# EAGLE design untitled (EAGLE 9.4.1)
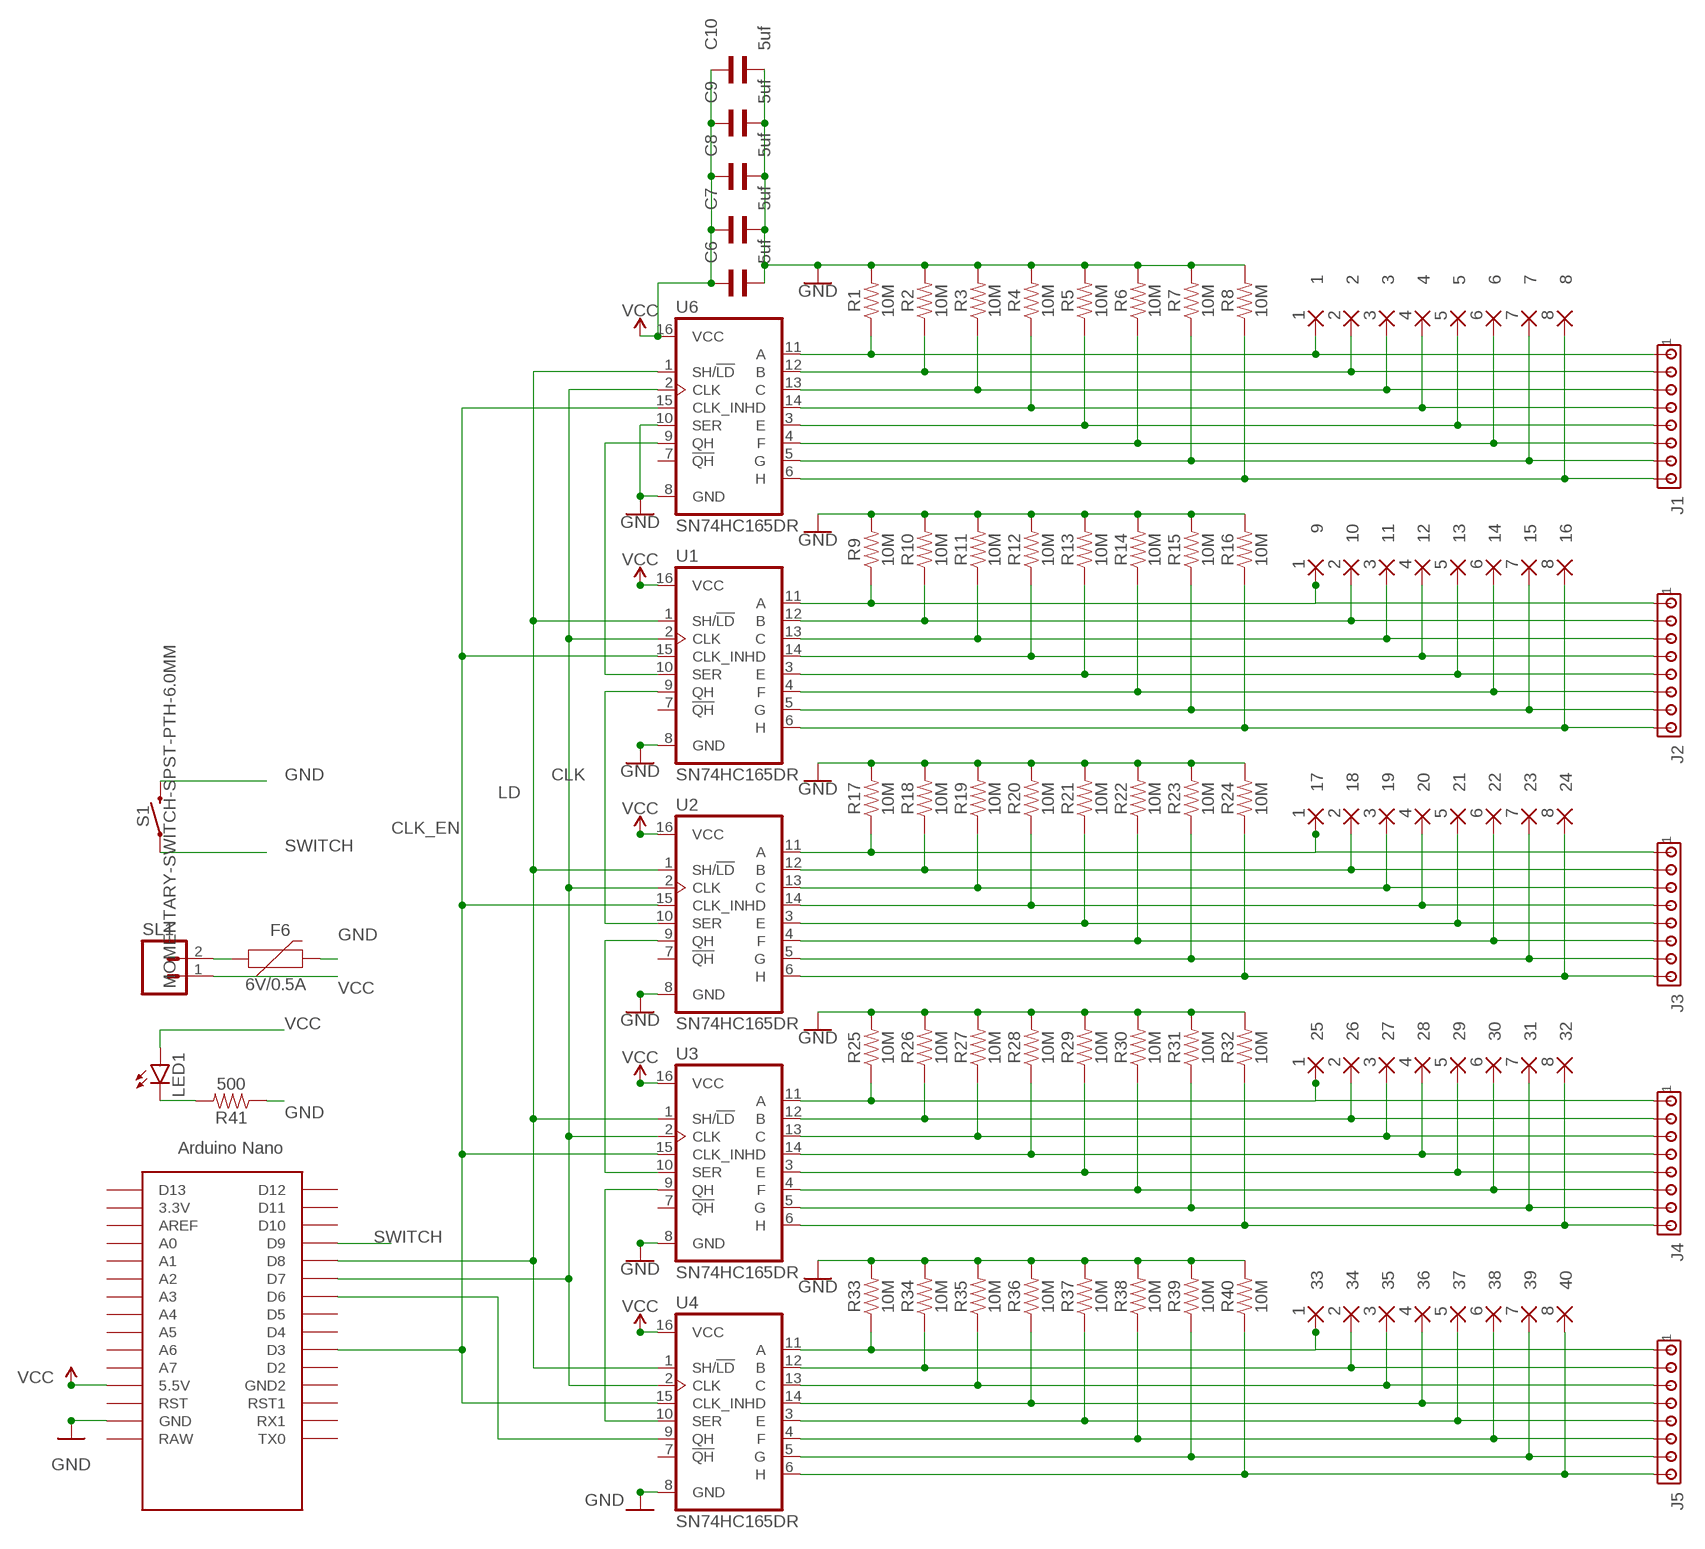
[diagram p0: schematic, sheet 1]

## Parts
1  1  WIREPADSMD5-1,8  [5-1,8]
2  2  WIREPADSMD5-1,8  [5-1,8]
3  3  WIREPADSMD5-1,8  [5-1,8]
4  4  WIREPADSMD5-1,8  [5-1,8]
5  5  WIREPADSMD5-1,8  [5-1,8]
6  6  WIREPADSMD5-1,8  [5-1,8]
7  7  WIREPADSMD5-1,8  [5-1,8]
8  8  WIREPADSMD5-1,8  [5-1,8]
9  1  WIREPADSMD5-1,8  [5-1,8]
10  2  WIREPADSMD5-1,8  [5-1,8]
11  3  WIREPADSMD5-1,8  [5-1,8]
12  4  WIREPADSMD5-1,8  [5-1,8]
13  5  WIREPADSMD5-1,8  [5-1,8]
14  6  WIREPADSMD5-1,8  [5-1,8]
15  7  WIREPADSMD5-1,8  [5-1,8]
16  8  WIREPADSMD5-1,8  [5-1,8]
17  1  WIREPADSMD5-1,8  [5-1,8]
18  2  WIREPADSMD5-1,8  [5-1,8]
19  3  WIREPADSMD5-1,8  [5-1,8]
20  4  WIREPADSMD5-1,8  [5-1,8]
21  5  WIREPADSMD5-1,8  [5-1,8]
22  6  WIREPADSMD5-1,8  [5-1,8]
23  7  WIREPADSMD5-1,8  [5-1,8]
24  8  WIREPADSMD5-1,8  [5-1,8]
25  1  WIREPADSMD5-1,8  [5-1,8]
26  2  WIREPADSMD5-1,8  [5-1,8]
27  3  WIREPADSMD5-1,8  [5-1,8]
28  4  WIREPADSMD5-1,8  [5-1,8]
29  5  WIREPADSMD5-1,8  [5-1,8]
30  6  WIREPADSMD5-1,8  [5-1,8]
31  7  WIREPADSMD5-1,8  [5-1,8]
32  8  WIREPADSMD5-1,8  [5-1,8]
33  1  WIREPADSMD5-1,8  [5-1,8]
34  2  WIREPADSMD5-1,8  [5-1,8]
35  3  WIREPADSMD5-1,8  [5-1,8]
36  4  WIREPADSMD5-1,8  [5-1,8]
37  5  WIREPADSMD5-1,8  [5-1,8]
38  6  WIREPADSMD5-1,8  [5-1,8]
39  7  WIREPADSMD5-1,8  [5-1,8]
40  8  WIREPADSMD5-1,8  [5-1,8]
C6  5uf  WCAP-CSGP_1206_885012208119  [WCAP-CSGP_1206]
C7  5uf  WCAP-CSGP_1206_885012208119  [WCAP-CSGP_1206]
C8  5uf  WCAP-CSGP_1206_885012208119  [WCAP-CSGP_1206]
C9  5uf  WCAP-CSGP_1206_885012208119  [WCAP-CSGP_1206]
C10  5uf  WCAP-CSGP_1206_885012208119  [WCAP-CSGP_1206]
F6  6V/0.5A  PPTC_HALF-AMP  [1206]
J1  MTA08-100  [10X08MTA]
J2  MTA08-100  [10X08MTA]
J3  MTA08-100  [10X08MTA]
J4  MTA08-100  [10X08MTA]
J5  MTA08-100  [10X08MTA]
LED1  LEDSML0805  [SML0805]
R1  10M  10MOHM-0603-1/10W-5%  [0603]
R2  10M  10MOHM-0603-1/10W-5%  [0603]
R3  10M  10MOHM-0603-1/10W-5%  [0603]
R4  10M  10MOHM-0603-1/10W-5%  [0603]
R5  10M  10MOHM-0603-1/10W-5%  [0603]
R6  10M  10MOHM-0603-1/10W-5%  [0603]
R7  10M  10MOHM-0603-1/10W-5%  [0603]
R8  10M  10MOHM-0603-1/10W-5%  [0603]
R9  10M  10MOHM-0603-1/10W-5%  [0603]
R10  10M  10MOHM-0603-1/10W-5%  [0603]
R11  10M  10MOHM-0603-1/10W-5%  [0603]
R12  10M  10MOHM-0603-1/10W-5%  [0603]
R13  10M  10MOHM-0603-1/10W-5%  [0603]
R14  10M  10MOHM-0603-1/10W-5%  [0603]
R15  10M  10MOHM-0603-1/10W-5%  [0603]
R16  10M  10MOHM-0603-1/10W-5%  [0603]
R17  10M  10MOHM-0603-1/10W-5%  [0603]
R18  10M  10MOHM-0603-1/10W-5%  [0603]
R19  10M  10MOHM-0603-1/10W-5%  [0603]
R20  10M  10MOHM-0603-1/10W-5%  [0603]
R21  10M  10MOHM-0603-1/10W-5%  [0603]
R22  10M  10MOHM-0603-1/10W-5%  [0603]
R23  10M  10MOHM-0603-1/10W-5%  [0603]
R24  10M  10MOHM-0603-1/10W-5%  [0603]
R25  10M  10MOHM-0603-1/10W-5%  [0603]
R26  10M  10MOHM-0603-1/10W-5%  [0603]
R27  10M  10MOHM-0603-1/10W-5%  [0603]
R28  10M  10MOHM-0603-1/10W-5%  [0603]
R29  10M  10MOHM-0603-1/10W-5%  [0603]
R30  10M  10MOHM-0603-1/10W-5%  [0603]
R31  10M  10MOHM-0603-1/10W-5%  [0603]
R32  10M  10MOHM-0603-1/10W-5%  [0603]
R33  10M  10MOHM-0603-1/10W-5%  [0603]
R34  10M  10MOHM-0603-1/10W-5%  [0603]
R35  10M  10MOHM-0603-1/10W-5%  [0603]
R36  10M  10MOHM-0603-1/10W-5%  [0603]
R37  10M  10MOHM-0603-1/10W-5%  [0603]
R38  10M  10MOHM-0603-1/10W-5%  [0603]
R39  10M  10MOHM-0603-1/10W-5%  [0603]
R40  10M  10MOHM-0603-1/10W-5%  [0603]
R41  500  10MOHM-0603-1/10W-5%  [0603]
S1  MOMENTARY-SWITCH-SPST-PTH-6.0MM  [TACTILE_SWITCH_PTH_6.0MM]
SL1  M02  [02P]
U1  SN74HC165DR  74HC165D  [SO16]
U2  SN74HC165DR  74HC165D  [SO16]
U3  SN74HC165DR  74HC165D  [SO16]
U4  SN74HC165DR  74HC165D  [SO16]
U6  SN74HC165DR  74HC165D  [SO16]
U$1  NANO  [NANO]

## Nets
B1: 2.1(P) J1.2 R2.1 U6.12(B)
C1: 3.1(P) J1.3 R3.1 U6.13(C)
CLK: U1.2(CLK) U2.2(CLK) U3.2(CLK) U4.2(CLK) U6.2(CLK) U$1.D7
CLK_EN: U1.15(CLK_INH) U2.15(CLK_INH) U3.15(CLK_INH) U4.15(CLK_INH) U6.15(CLK_INH) U$1.D3
D1: 4.1(P) J1.4 R4.1 U6.14(D)
E1: 5.1(P) J1.5 R5.1 U6.3(E)
F1: 6.1(P) J1.6 R6.1 U6.4(F)
G1: 7.1(P) J1.7 R7.1 U6.5(G)
GND [vcc]: C6.1 C7.1 C8.1 C9.1 C10.1 F6.2 R1.2 R2.2 R3.2 R4.2 R5.2 R6.2 R7.2 R8.2 R9.2 R10.2 R11.2 R12.2 R13.2 R14.2 R15.2 R16.2 R17.2 R18.2 R19.2 R20.2 R21.2 R22.2 R23.2 R24.2 R25.2 R26.2 R27.2 R28.2 R29.2 R30.2 R31.2 R32.2 R33.2 R34.2 R35.2 R36.2 R37.2 R38.2 R39.2 R40.2 R41.1 S1.3 U1.8(GND) U2.8(GND) U3.8(GND) U4.8(GND) U6.8(GND) U6.10(SER) U$1.GND
H1: 8.1(P) J1.8 R8.1 U6.6(H)
LD: U1.1(SH/!LD) U2.1(SH/!LD) U3.1(SH/!LD) U4.1(SH/!LD) U6.1(SH/!LD) U$1.D8
N$1: U1.10(SER) U6.9(QH)
N$2: U1.9(QH) U2.10(SER)
N$3: U2.9(QH) U3.10(SER)
N$4: U3.9(QH) U4.10(SER)
N$5: 1.1(P) J1.1 R1.1 U6.11(A)
N$6: F6.1 SL1.2
N$7: U4.9(QH) U$1.D6
N$11: LED1.C R41.2
N$15: 9.1(P) J2.1 R9.1 U1.11(A)
N$16: 10.1(P) J2.2 R10.1 U1.12(B)
N$17: 11.1(P) J2.3 R11.1 U1.13(C)
N$18: 12.1(P) J2.4 R12.1 U1.14(D)
N$19: 13.1(P) J2.5 R13.1 U1.3(E)
N$20: 14.1(P) J2.6 R14.1 U1.4(F)
N$21: 15.1(P) J2.7 R15.1 U1.5(G)
N$22: 16.1(P) J2.8 R16.1 U1.6(H)
N$23: 17.1(P) J3.1 R17.1 U2.11(A)
N$24: 18.1(P) J3.2 R18.1 U2.12(B)
N$25: 19.1(P) J3.3 R19.1 U2.13(C)
N$26: 20.1(P) J3.4 R20.1 U2.14(D)
N$27: 21.1(P) J3.5 R21.1 U2.3(E)
N$28: 22.1(P) J3.6 R22.1 U2.4(F)
N$29: 23.1(P) J3.7 R23.1 U2.5(G)
N$30: 24.1(P) J3.8 R24.1 U2.6(H)
N$31: 25.1(P) J4.1 R25.1 U3.11(A)
N$32: 26.1(P) J4.2 R26.1 U3.12(B)
N$33: 27.1(P) J4.3 R27.1 U3.13(C)
N$34: 28.1(P) J4.4 R28.1 U3.14(D)
N$35: 29.1(P) J4.5 R29.1 U3.3(E)
N$36: 30.1(P) J4.6 R30.1 U3.4(F)
N$37: 31.1(P) J4.7 R31.1 U3.5(G)
N$38: 32.1(P) J4.8 R32.1 U3.6(H)
N$39: 33.1(P) J5.1 R33.1 U4.11(A)
N$40: 34.1(P) J5.2 R34.1 U4.12(B)
N$41: 35.1(P) J5.3 R35.1 U4.13(C)
N$42: 36.1(P) J5.4 R36.1 U4.14(D)
N$43: 37.1(P) J5.5 R37.1 U4.3(E)
N$44: 38.1(P) J5.6 R38.1 U4.4(F)
N$45: 39.1(P) J5.7 R39.1 U4.5(G)
N$46: 40.1(P) J5.8 R40.1 U4.6(H)
SWITCH: S1.1 U$1.D9
VCC [vcc]: C6.2 C7.2 C8.2 C9.2 C10.2 LED1.A SL1.1 U1.16(VCC) U2.16(VCC) U3.16(VCC) U4.16(VCC) U6.16(VCC) U$1.5V(5.5V)
Unconnected: U1.7(!QH) U2.7(!QH) U3.7(!QH) U4.7(!QH) U6.7(!QH) U$1.3.3V U$1.A0 U$1.A1 U$1.A2 U$1.A3 U$1.A4 U$1.A5 U$1.A6 U$1.A7 U$1.AREF U$1.D2 U$1.D4 U$1.D5 U$1.D10 U$1.D11 U$1.D12 U$1.D13 U$1.GND1(GND2) U$1.ICSP1 U$1.ICSP2 U$1.ICSP3 U$1.ICSP4 U$1.ICSP5 U$1.ICSP6 U$1.RAW U$1.RST U$1.RST1 U$1.RX1 U$1.TX0

## Library data of the parts
1-40 = wirepad:WIREPAD: Wire PAD connect wire on PCB
C6-C10 = Wurth_Elektronik_Passive_Capacitors_rev18b:WCAP-CSGP_1206: WCAP-CSGP Ceramic Capacitors Characteristics Multilayer Ceramic Chip Capacitor Recommended soldering:Reflow, for 0603 and 0805 wave soldering is also allowed Operating temperature:-55 °C to +125 °C; Ceramic characteristics: Class I - NPO ; Class II -X7R, X5R High performance ceramic High capacitance stability Minimal aging Termination:Cu/Ni/Sn <http://katalog.we-online.de/media/images/eisos/WCAP-CSGP_pf2.jpg> Details see: http://katalog.we-online.de/en/pbs/WCAP-CSGP-1206? Created: 2015-01-28 2015 (C) Wurth Elektronik
F6 = SparkFun-Fuses:PPTC: Resettable Fuse PPTC Resettable Fuse. Really a sort of resistor with a polymeric positive temperature coefficient whose resistance increases dramatically with an increase in temperature. When heated by the power passing through the resistance rises causing the current to be limited, protecting the circuit. This is achieved by the transition of the polymer from a crystalline to an amorphous state where the conductive carbon separates breaking the conductive pathways found in the cool crystalline structure. When a PPTC cools back down it resumes conducting letting the circuit turn back on. SparkFun Products: SparkFun RedBoard - Programmed with Arduino <https://www.sparkfun.com/products/12757> Pro Micro - 5V/16MHz <https://www.sparkfun.com/products/12640> Arduino Pro 328 - 5V/16MHz <https://www.sparkfun.com/products/10915> MP3 Trigger <https://www.sparkfun.com/products/13720>; PROD_ID: RES-08585
J1-J5 = con-amp:MTA08-100: AMP connector
LED1 = led:LED: LED OSRAM: - CHIPLED LG R971, LG N971, LY N971, LG Q971, LY Q971, LO R971, LY R971 LH N974, LH R974 LS Q976, LO Q976, LY Q976 LO Q996 - Hyper CHIPLED LW Q18S LB Q993, LB Q99A, LB R99A - SideLED LS A670, LO A670, LY A670, LG A670, LP A670 LB A673, LV A673, LT A673, LW A673 LH A674 LY A675 LS A676, LA A676, LO A676, LY A676, LW A676 LS A679, LY A679, LG A679 - Hyper Micro SIDELED® LS Y876, LA Y876, LO Y876, LY Y876 LT Y87S - SmartLED LW L88C, LW L88S LB L89C, LB L89S, LG L890 LS L89K, LO L89K, LY L89K LS L896, LA L896, LO L896, LY L896 - TOPLED LS T670, LO T670, LY T670, LG T670, LP T670 LSG T670, LSP T670, LSY T670, LOP T670, LYG T670 LG T671, LOG T671, LSG T671 LB T673, LV T673, LT T673, LW T673 LH T674 LS T676, LA T676, LO T676, LY T676, LB T676, LH T676, LSB T676, LW T676 LB T67C, LV T67C, LT T67C, LS T67K, LO T67K, LY T67K, LW E67C LS E67B, LA E67B, LO E67B, LY E67B, LB E67C, LV E67C, LT E67C LW T67C LS T679, LY T679, LG T679 LS T770, LO T770, LY T770, LG T770, LP T770 LB T773, LV T773, LT T773, LW T773 LH T774 LS E675, LA E675, LY E675, LS T675 LS T776, LA T776, LO T776, LY T776, LB T776 LHGB T686 LT T68C, LB T68C - Hyper Mini TOPLED® LB M676 - Mini TOPLED Santana® LG M470 LS M47K, LO M47K, LY M47K Source: http://www.osram.convergy.de LUXEON: - LUMILED® LXK2-PW12-R00, LXK2-PW12-S00, LXK2-PW14-U00, LXK2-PW14-V00 LXK2-PM12-R00, LXK2-PM12-S00, LXK2-PM14-U00 LXK2-PE12-Q00, LXK2-PE12-R00, LXK2-PE12-S00, LXK2-PE14-T00, LXK2-PE14-U00 LXK2-PB12-K00, LXK2-PB12-L00, LXK2-PB12-M00, LXK2-PB14-N00, LXK2-PB14-P00, LXK2-PB14-Q00 LXK2-PR12-L00, LXK2-PR12-M00, LXK2-PR14-Q00, LXK2-PR14-R00 LXK2-PD12-Q00, LXK2-PD12-R00, LXK2-PD12-S00 LXK2-PH12-R00, LXK2-PH12-S00 LXK2-PL12-P00, LXK2-PL12-Q00, LXK2-PL12-R00 Source: www.luxeon.com KINGBRIGHT: KA-3528ASYC Source: www.kingbright.com
R1-R40 = SparkFun-Resistors:10MOHM: RES-09327; PROD_ID: RES-08283
R41 = SparkFun-Resistors:10MOHM: RES-09327; PROD_ID: RES-08283; VALUE: 10M
S1 = SparkFun-Switches:MOMENTARY-SWITCH-SPST: Momentary Switch (Pushbutton) - SPST Normally-open (NO) SPST momentary switches (buttons, pushbuttons). Variants PTH-12MM - 12mm square, through-hole Momentary Pushbutton Switch - 12mm Square <https://www.sparkfun.com/products/9190> (COM-09190) PTH-6.0MM, PTH-6.0MM-KIT - 6.0mm square, through-hole Mini Pushbutton Switch <https://www.sparkfun.com/products/97> (COM-00097) KIT package intended for soldering kit's - only one side of pads' copper is exposed. PTH-RIGHT-ANGLE-KIT - Right-angle, through-hole Right Angle Tactile Button <https://www.sparkfun.com/products/10791> - Used on SparkFun BigTime Watch Kit <https://www.sparkfun.com/products/11734> SMD-12MM - 12mm square, surface-mount Tactile Button - SMD (12mm) <https://www.sparkfun.com/products/12993> (COM-12993) Used on SparkFun PicoBoard <https://www.sparkfun.com/products/11888> SMD-4.5MM - 4.5mm Square Trackball Switch Used on SparkFun Blackberry Trackballer Breakout <https://www.sparkfun.com/products/13169> SMD-4.6MMX2.8MM - 4.60mm x 2.80mm, surface mount Used on SparkFun SAMD21 Mini Breakout <https://www.sparkfun.com/products/13664> SMD-5.2MM, SMD-5.2-REDUNDANT - 5.2mm square, surface-mount Mini Pushbutton Switch - SMD <https://www.sparkfun.com/products/8720> (COM-08720) Used on Arduino Pro Mini <https://www.sparkfun.com/products/11114> REDUNDANT package connects both switch circuits together SMD-6.0X3.5MM - 6.0 x 3.5mm, surface mount Momentary Reset Switch SMD <https://www.sparkfun.com/products/8229> (COM-08229) SMD-6.2MM-TALL - 6.2mm square, surface mount Tactile Button - SMD (6mm) <https://www.sparkfun.com/products/12992> Used on SparkFun Digital Sandbox <https://www.sparkfun.com/products/12651> SMD-RIGHT-ANGLE - Right-angle, surface mount Used on SparkFun Block for Intel® Edison - Arduino <https://www.sparkfun.com/products/13036>; PROD_ID: SWCH-08441; SF_SKU: COM-00097
SL1 = con-amp-quick:M02: AMP QUICK CONNECTOR; OC_FARNELL: unknown; OC_NEWARK: unknown
U1-U4 U6 = SparkFun-IC-Logic:74*165: 8-Bit Shift Register (Parallel to Serial) Datasheet <https://cdn.sparkfun.com/datasheets/BreakoutBoards/sn54hc165.pdf> SparkFun Products SparkFun Shift-In Breakout - SN74HC165 <https://www.sparkfun.com/products/11733> (BOB-11733); PROD_ID: IC-11325
U$1 = Arduino-clone:NANO: Arduino Nano

## Net classes
0 default: width 0.508 mm, drill 0.152 mm, clearance 0.254 mm
1 vcc: width 0.762 mm, drill 0.305 mm, clearance 0.381 mm

## Board
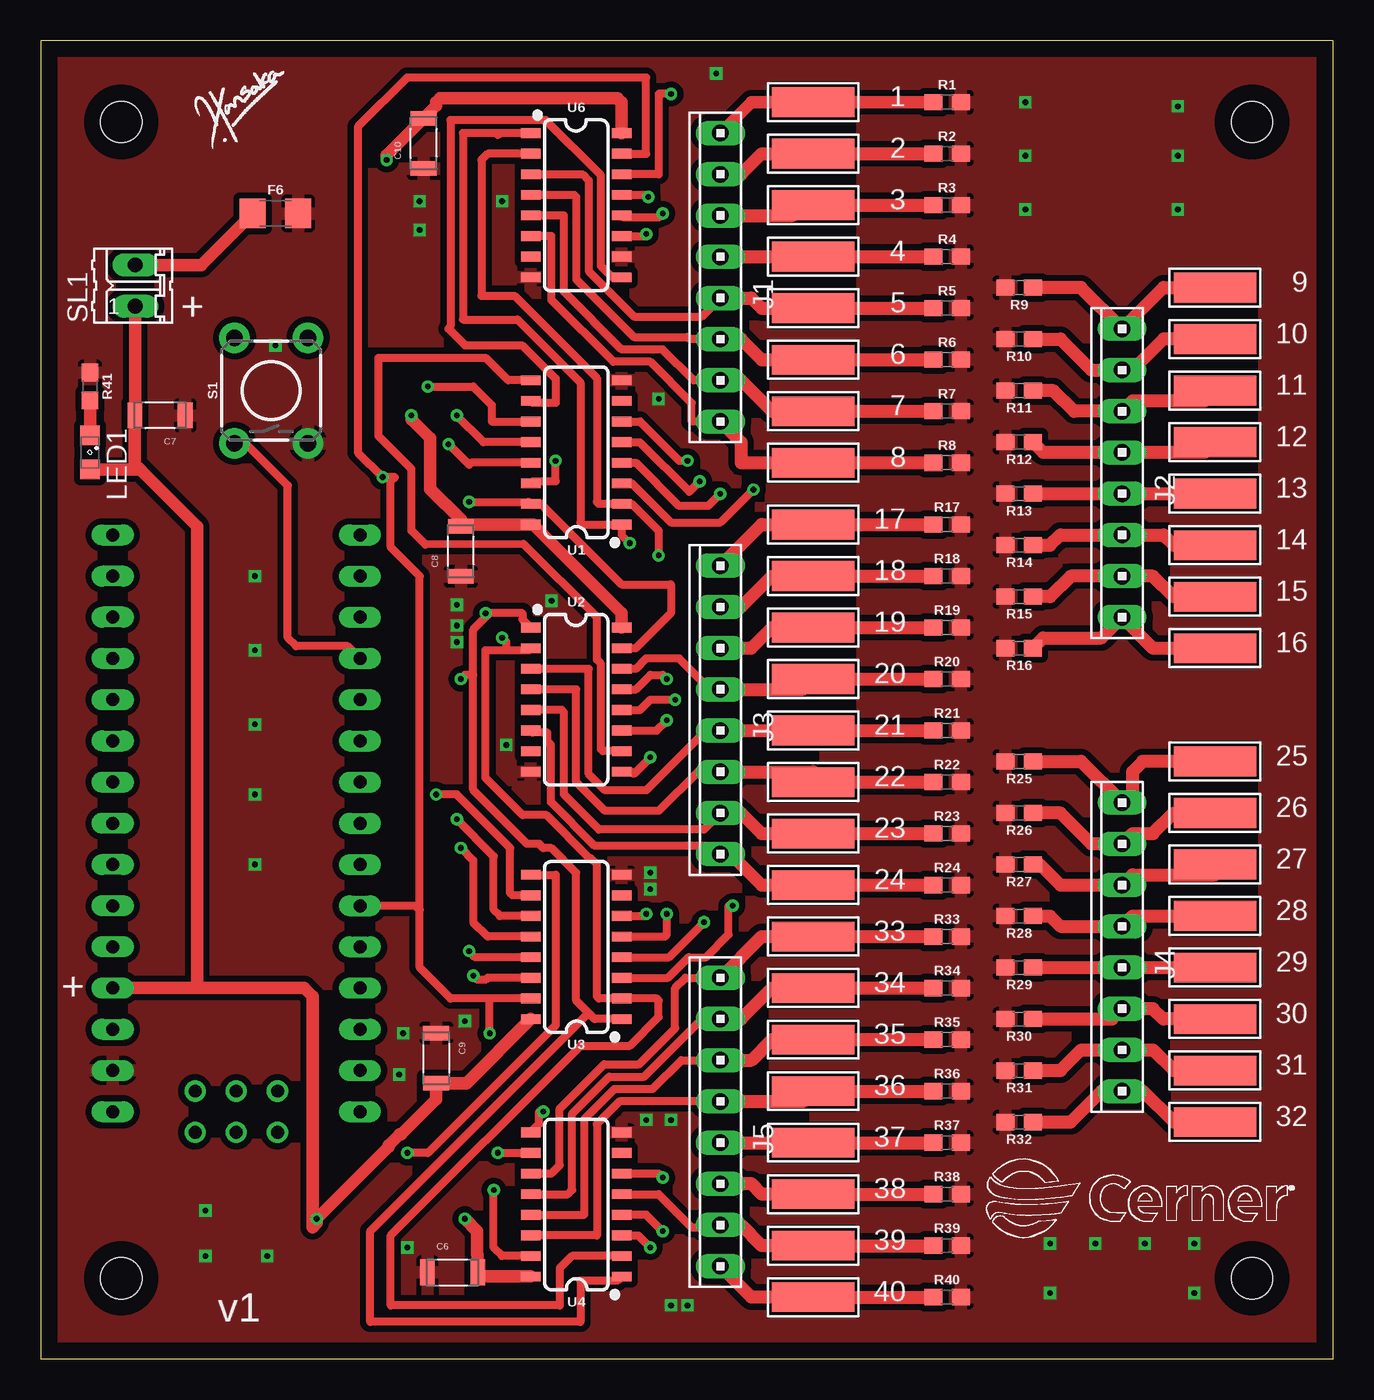
[diagram p1: board, top side]
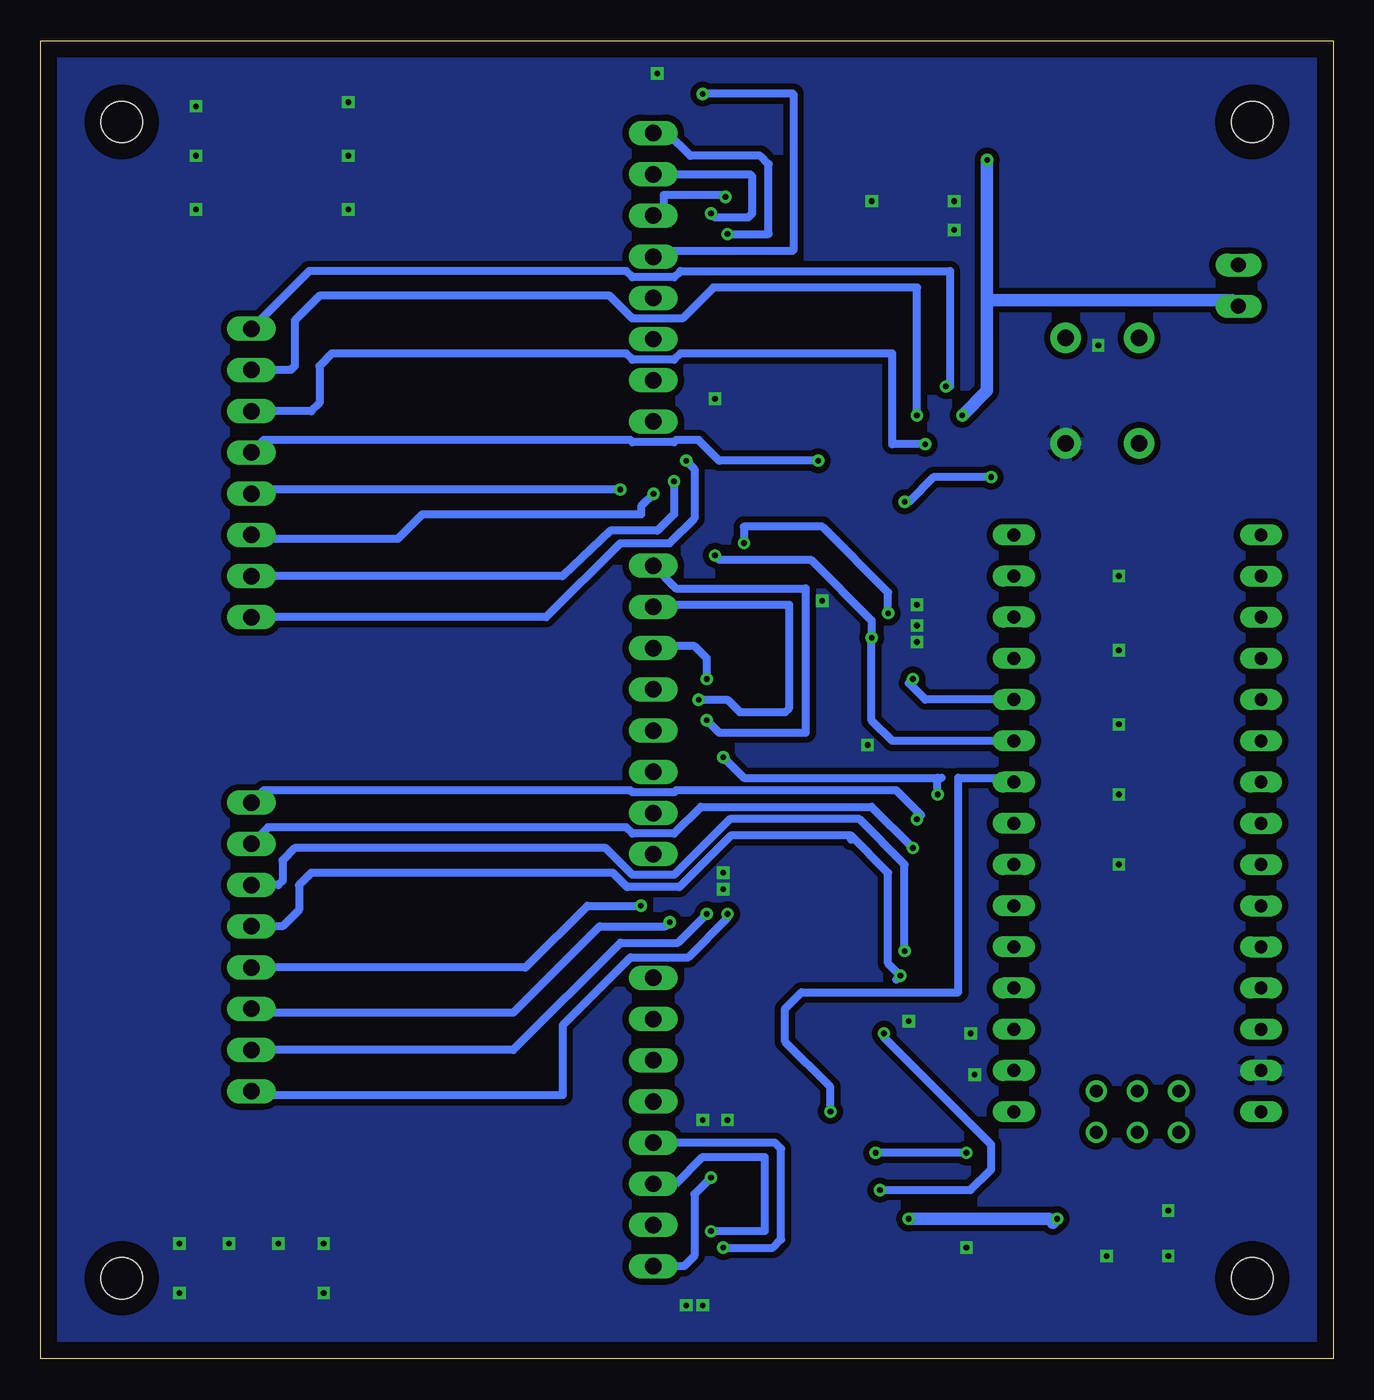
[diagram p2: board, bottom side, seen from below]

Size 79.68 x 81.27 mm. Coordinates in mm from the lower left corner, seen from the top.
Outline: 0,0 79.68,0 79.68,81.27 0,81.27 0,0
Copper layers (1*16): Top 0.035mm / dielectric 1.5mm / Bottom 0.035mm
Design rules "default": minimum track width 6mil, minimum drill 0.35mm, track to track 6mil, track to pad 6mil, pad to pad 6mil, via to via 6mil, smd to smd 6mil, copper to edge 40mil, drill to drill 6mil, minimum pad ring 10mil, minimum via ring 8mil, stop-mask expansion 4mil, vias tented up to drill 0mil, thermal gap 10mil

### Footprints (pad centres in the part's own frame; a part is rotated, then mirrored left to right if it is on the bottom)
5-1,8 = smd 1.829 x 5.08: 1 0,0
WCAP-CSGP_1206 = smd 0.9 x 1.6: 1 -1.55,0; 2 1.55,0
1206 = smd 1.6 x 1.8: 1 -1.4,0; 2 1.4,0
10X08MTA = drill 1.016 long: 1 8.89,0; 2 6.35,0; 3 3.81,0; 4 1.27,0; 5 -1.27,0; 6 -3.81,0; 7 -6.35,0; 8 -8.89,0
SML0805 = smd 1.2 x 1.2: A 1.05,0; C -1.05,0
0603 = smd 1.1 x 1: 1 -0.85,0; 2 0.85,0
TACTILE_SWITCH_PTH_6.0MM = drill 1.016 pad 1.88: 1 -3.251,2.261; 2 3.251,2.261; 3 -3.251,-2.261; 4 3.251,-2.261
02P = drill 0.914 long: 1 -1.27,0; 2 1.27,0
SO16 = smd 0.6 x 1.2: 1 -4.445,-2.8; 2 -3.175,-2.8; 3 -1.905,-2.8; 4 -0.635,-2.8; 5 0.635,-2.8; 6 1.905,-2.8; 7 3.175,-2.8; 8 4.445,-2.8; 9 4.445,2.8; 10 3.175,2.8; 11 1.905,2.8; 12 0.635,2.8; 13 -0.635,2.8; 14 -1.905,2.8; 15 -3.175,2.8; 16 -4.445,2.8
NANO = drill 0.8 long: 3.3V -10.16,24.13; 5V -10.16,-1.27; A0 -10.16,19.05; A1 -10.16,16.51; A2 -10.16,13.97; A3 -10.16,11.43; A4 -10.16,8.89; A5 -10.16,6.35; A6 -10.16,3.81; A7 -10.16,1.27; AREF -10.16,21.59; D2 5.08,1.27; D3 5.08,3.81; D4 5.08,6.35; D5 5.08,8.89; D6 5.08,11.43; D7 5.08,13.97; D8 5.08,16.51; D9 5.08,19.05; D10 5.08,21.59; D11 5.08,24.13; D12 5.08,26.67; D13 -10.16,26.67; GND -10.16,-6.35; GND1 5.08,-1.27; RAW -10.16,-8.89; RST -10.16,-3.81; RST1 5.08,-3.81; RX1 5.08,-6.35; TX0 5.08,-8.89 | drill 0.8: ICSP1 -5.08,-10.16; ICSP2 -5.08,-7.62; ICSP3 -2.54,-10.16; ICSP4 -2.54,-7.62; ICSP5 0,-10.16; ICSP6 0,-7.62
DRILL_0.1000 = hole 2.54: 0,0

### Placement (x,y rotation side)
1  47.62,77.47 90 top
2  47.62,74.3 90 top
3  47.62,71.12 90 top
4  47.62,67.94 90 top
5  47.62,64.77 90 top
6  47.62,61.59 90 top
7  47.62,58.42 90 top
8  47.62,55.24 90 top
9  72.39,66.04 90 top
10  72.39,62.87 90 top
11  72.39,59.69 90 top
12  72.39,56.52 90 top
13  72.39,53.34 90 top
14  72.39,50.16 90 top
15  72.39,46.99 90 top
16  72.39,43.81 90 top
17  47.62,51.44 90 top
18  47.62,48.26 90 top
19  47.62,45.09 90 top
20  47.62,41.91 90 top
21  47.62,38.73 90 top
22  47.62,35.56 90 top
23  47.62,32.38 90 top
24  47.62,29.21 90 top
25  72.39,36.83 90 top
26  72.39,33.66 90 top
27  72.39,30.48 90 top
28  72.39,27.3 90 top
29  72.39,24.13 90 top
30  72.39,20.95 90 top
31  72.39,17.78 90 top
32  72.39,14.61 90 top
33  47.62,26.04 90 top
34  47.62,22.86 90 top
35  47.62,19.68 90 top
36  47.62,16.51 90 top
37  47.62,13.34 90 top
38  47.62,10.16 90 top
39  47.62,6.99 90 top
40  47.62,3.81 90 top
C6  25.4,5.33 0 top
C7  7.37,58.17 180 top
C8  25.91,49.78 90 top
C9  24.38,18.54 270 top
C10  23.62,74.93 90 top
F6  14.48,70.61 0 top
J1  41.91,66.67 90 top
J2  66.67,54.61 90 top
J3  41.91,40.01 90 top
J4  66.67,25.4 90 top
J5  41.91,14.61 90 top
LED1  3.05,55.88 270 top
R1  55.88,77.47 0 top
R2  55.88,74.3 0 top
R3  55.88,71.12 0 top
R4  55.88,67.94 0 top
R5  55.88,64.77 0 top
R6  55.88,61.59 0 top
R7  55.88,58.42 0 top
R8  55.88,55.24 0 top
R9  60.33,66.04 180 top
R10  60.33,62.87 180 top
R11  60.33,59.69 180 top
R12  60.33,56.52 180 top
R13  60.33,53.34 180 top
R14  60.33,50.16 180 top
R15  60.33,46.99 180 top
R16  60.33,43.81 180 top
R17  55.88,51.44 0 top
R18  55.88,48.26 0 top
R19  55.88,45.09 0 top
R20  55.88,41.91 0 top
R21  55.88,38.73 0 top
R22  55.88,35.56 0 top
R23  55.88,32.38 0 top
R24  55.88,29.21 0 top
R25  60.33,36.83 180 top
R26  60.33,33.66 180 top
R27  60.33,30.48 180 top
R28  60.33,27.3 180 top
R29  60.33,24.13 180 top
R30  60.33,20.95 180 top
R31  60.33,17.78 180 top
R32  60.33,14.61 180 top
R33  55.88,26.04 0 top
R34  55.88,22.86 0 top
R35  55.88,19.68 0 top
R36  55.88,16.51 0 top
R37  55.88,13.34 0 top
R38  55.88,10.16 0 top
R39  55.88,6.99 0 top
R40  55.88,3.81 0 top
R41  3.05,59.94 270 top
S1  14.22,59.69 90 top
SL1  5.84,66.17 90 top
U1  33.02,55.88 90 top
U2  33.02,40.64 270 top
U3  33.02,25.4 90 top
U4  33.02,9.53 90 top
U6  33.02,71.12 270 top
U$1  14.61,24.13 0 top
U$2  [DRILL_0.1000]  74.68,76.25 0 top
U$3  [DRILL_0.1000]  4.98,4.98 0 top
U$4  [DRILL_0.1000]  4.98,76.25 0 top
U$5  [DRILL_0.1000]  74.68,4.98 0 top
U$6  [SIGNATURE]  9.4,73.41 0 top
U$7  [CERNER]  57.66,7.11 0 top

### Tracks (layer width: path | path; a pad name or v marks a point on that pad's centre or on a via)
B1  (via drill 0.35)
  Top 0.508: 41.27,73.03 J1.2 | U6.12 35.95,70.36 38.1,70.36 v38.35,70.61
  Top 0.813: R2.1 2.1 44.45,74.3 43.18,73.03 J1.2
  Bottom 0.508: J1.2 35.94,73.03 35.81,72.9 35.81,70.61 36.07,70.36 38.1,70.36 v38.35,70.61
C1  (via drill 0.35)
  Top 0.508: U6.13 37.34,71.75 v37.46,71.63
  Top 0.813: R3.1 3.1 46.99,71.12 46.35,70.48 J1.3
  Bottom 0.508: v37.46,71.63 37.59,71.75 41.27,71.75 41.27,71.12 J1.3
CLK  (via drill 0.35)
  Top 0.508: U6.2 27.56,74.3 27.18,73.91 27.18,65.53 29.21,65.53 34.29,60.45 34.29,52.83 34.42,52.7 U1.2 36.45,52.7 38.1,51.05 v38.1,49.53 | v28.45,44.45 28.7,44.2 28.7,43.69 | 28.7,43.69 27.43,43.69 27.43,35.81 29.72,33.53 31.18,33.53 33.85,30.86 33.91,30.86 34.29,30.48 34.29,22.35 34.42,22.23 U3.2 37.97,22.23 38.1,22.1 38.1,21.08 36.32,19.3 33.27,19.3 21.59,7.62 21.59,3.3 32,3.3 32,5.59 32.77,6.35 U4.2 | 28.7,43.69 30.09,43.69 U2.2
  Bottom 0.508: v38.1,49.53 37.85,49.28 32.2,49.28 28.45,45.53 v28.45,44.45 28.45,39.37 27.18,38.1 U$1.D7
CLK_EN  (via drill 0.35)
  Top 0.508: U6.15 37.34,74.3 37.34,78.99 22.61,78.99 19.56,75.95 19.56,55.88 v21.08,54.36 21.84,54.36 21.59,54.1 21.59,50.04 23.37,48.26 23.37,27.69 | v26.42,52.83 30.09,52.83 U1.15 30.86,52.7 35.81,47.75 38.86,47.75 38.86,45.97 36.7,43.81 U2.15 | U3.15 27.69,22.23 | 27.69,22.23 25.27,22.23 23.37,24.13 23.37,27.69 | 23.37,27.69 23.11,27.94 U$1.D3 | U4.15 28.45,6.35 27.94,6.86 v27.94,10.41 | v27.69,20.07 27.69,22.23
  Bottom 0.508: v21.08,54.36 24.64,54.36 26.16,52.83 v26.42,52.83 | v27.94,10.41 22.35,10.41 21.08,11.68 21.08,13.21 27.69,19.81 v27.69,20.07
D1  (via drill 0.35)
  Top 0.508: v38.86,77.98 38.1,77.98 38.1,73.03 U6.14
  Top 0.813: R4.1 4.1 J1.4
  Bottom 0.508: J1.4 41.53,68.33 33.27,68.33 33.27,77.98 v38.86,77.98
E1
  Top 0.508: U6.3 33.4,73.03 33.78,72.64 33.78,67.06 36.58,64.26 40.77,64.26 J1.5
  Top 0.813: R5.1 5.1 44.45,64.77 43.81,65.41 J1.5
F1
  Top 0.508: J1.6 40.01,62.87 39.88,62.99 36.58,62.99 33.02,66.55 33.02,71.63 32.89,71.75 U6.4
  Top 0.813: R6.1 6.1 44.45,61.59 43.18,62.87 J1.6
G1
  Top 0.508: 41.4,60.33 J1.7 40.26,60.33 38.35,62.23 35.81,62.23 32.26,65.79 32.26,70.48 U6.5
  Top 0.813: R7.1 7.1 45.09,58.42 43.18,60.33 J1.7
GND  (via drill 0.35)
  other vias: 14.48,62.48 23.37,71.37 23.37,69.6 28.45,71.37 41.66,79.25 13.21,48.26 13.21,43.69 13.21,39.12 13.21,34.8 13.21,30.48 10.16,9.14 10.16,6.35 13.97,6.35 38.86,3.3 22.61,6.86 65.02,7.11 68.07,7.11 62.23,4.06 60.71,77.47 60.71,74.17 60.71,70.87 70.1,77.22 70.1,74.17 70.1,70.87 62.23,7.11 71.12,7.11 71.12,4.06 25.65,45.21 25.65,44.2 25.65,46.48 37.59,29.97 37.59,28.96 39.88,3.3 37.34,14.73 38.86,14.73 28.7,37.85 31.5,46.74 26.16,20.83 22.35,20.07 22.1,17.53 38.1,59.18
  pour Top: -1.02,83.57 81.03,83.57 81.53,83.06 81.53,-2.03 -1.27,-2.03 -2.03,-1.27 -2.03,82.55
  pour Bottom: -3.3,85.34 82.3,85.34 82.55,85.09 82.55,-2.54 83.31,-3.3 -3.3,-3.3 -3.56,-3.05 -3.56,85.09
H1
  Top 0.508: J1.8 40.13,57.78 40.13,58.93 37.59,61.47 35.31,61.47 31.5,65.28 31.5,69.22 U6.6
  Top 0.813: R8.1 8.1 43.18,55.24 43.18,56.52 J1.8
LD  (via drill 0.35)
  Top 0.508: 28.19,75.44 28.32,75.56 U6.1 26.04,75.56 26.04,64.07 29.4,64.07 33.27,60.2 33.27,51.56 33.4,51.44 U1.1 35.82,50.79 v36.32,50.29 | U2.1 29.71,45.59 29.71,45.97 v27.43,45.97 27.56,45.85 26.67,44.96 26.67,42.16 | U3.1 34.16,20.95 33.91,21.21 | 33.91,21.21 33.02,22.1 33.02,29.97 31.5,31.5 30.99,31.5 30.73,31.75 29.98,31.75 26.67,35.09 26.67,42.16 | U4.1 35.57,4.83 33.27,4.83 33.27,2.29 20.32,2.29 20.32,7.87 33.66,21.21 33.91,21.21 | 26.67,42.16 26.16,42.16 v25.91,41.91
  Bottom 0.508: v27.43,45.97 27.43,47.24 31.5,51.31 36.32,51.31 v36.32,50.29 | U$1.D8 25.15,40.64 26.16,41.66 v25.91,41.91
N$1
  Top 0.508: U6.9 35.24,66.67 34.54,67.37 34.54,72.96 31.13,76.37 25.27,76.37 25.27,63.63 25.15,63.5 26.16,62.48 29.68,62.48 31.71,60.45 31.75,60.45 31.75,58.93 30.35,58.93 U1.10
N$2
  Top 0.508: U1.9 28.83,60.33 27.43,61.72 20.83,61.72 20.83,56.9 22.86,54.86 22.86,51.05 23.72,50.19 29.77,50.24 34.29,45.72 34.29,43.12 34.54,42.86 34.54,37.59 34.67,37.47 U2.10
N$3  (via drill 0.35)
  Top 0.508: U2.9 36.45,36.2 36.58,36.07 v37.59,37.08 | U3.10 29.08,28.57 28.96,28.7 28.96,31.5 25.65,34.8 v24.38,34.8
  Bottom 0.508: v37.59,37.08 36.32,35.81 24.38,35.81 | 24.38,35.81 24.13,35.81 | v24.38,34.8 24.38,35.81
N$4  (via drill 0.35)
  Top 0.508: U3.9 31.75,29.84 31.75,20.57 23.88,12.7 v22.61,12.7 | v28.19,12.7 U4.10
  Bottom 0.508: v22.61,12.7 v28.19,12.7
N$5  (via drill 0.35)
  Top 0.508: U6.11 37.34,69.22 v37.34,69.34
  Top 0.762: R1.1 1.1 47.24,77.47 | 47.24,77.47 46.99,77.22 | J1.1 43.81,77.47 47.24,77.47
  Bottom 0.508: v37.34,69.34 34.8,69.34 34.8,73.66 35.31,74.17 39.62,74.17 41.02,75.56 J1.1
N$6
  Top 0.762: F6.1 9.9,67.44 SL1.2
N$7  (via drill 0.35)
  Top 0.508: U4.9 30.73,14.48 30.73,15.24 v30.99,15.24
  Bottom 0.508: v30.99,15.24 30.99,16.76 33.78,19.56 33.78,21.59 32.77,22.61 23.11,22.61 23.11,35.81 19.94,35.81 U$1.D6
N$11
  Top 0.762: LED1.C R41.2
N$15  (via drill 0.35)
  Top 0.508: U1.11 27.81,57.78 27.81,58.8 26.67,59.94 v23.88,59.94
  Top 0.762: R9.1 64.14,66.04
  Top 0.813: 9.1 69.22,66.04 J2.1 64.14,66.04 61.59,66.04
  Bottom 0.508: J2.1 63.12,67.06 43.58,67.06 43.2,66.67 40.62,66.67 40.24,67.06 23.62,67.06 23.62,59.94 v23.88,59.94
N$16  (via drill 0.35)
  Top 0.508: U1.12 27.3,56.52 v25.65,58.17
  Top 0.813: R10.1 62.87,62.87 64.77,60.96 J2.2 67.31,60.96 69.22,62.87 10.1
  Bottom 0.508: v25.65,58.17 25.65,66.04 38.21,66.04 40.11,64.14 43.2,64.14 44.59,65.53 62.48,65.53 64.01,64.01 64.01,61.21 64.26,60.96 J2.2
N$17  (via drill 0.35)
  Top 0.508: U1.13 26.54,55.24 26.42,55.12 v25.15,56.39
  Top 0.813: 11.1 71.75,59.05 67.31,59.05 J2.3 63.72,58.42 62.45,59.69 R11.1
  Bottom 0.508: v25.15,56.39 27.18,56.39 27.18,61.98 40.24,61.98 40.62,61.59 43.2,61.59 43.58,61.98 61.72,61.98 62.48,61.21 62.48,58.93 62.99,58.42 J2.3
N$18  (via drill 0.35)
  Top 0.508: U1.14 30.35,54.1 31.75,54.1 v31.75,55.37
  Top 0.813: 12.1 71.75,55.88 J2.4 61.81,55.88 R12.1
  Bottom 0.508: v31.75,55.37 37.85,55.37 39.12,56.64 40.49,56.64 40.62,56.52 43.2,56.52 43.33,56.64 65.91,56.64 J2.4
N$19  (via drill 0.35)
  Top 0.508: U1.3 36.45,53.98 38.86,51.56 41.91,51.56 v43.94,53.59
  Top 0.813: R13.1 J2.5 13.1
  Bottom 0.508: v43.94,53.59 66.42,53.59 J2.5
N$20  (via drill 0.35)
  Top 0.508: U1.4 36.7,55.24 39.37,52.58 41.15,52.58 v41.89,53.32
  Top 0.813: R14.1 62.23,50.16 62.87,50.8 J2.6 69.22,50.8 69.85,50.16 14.1
  Bottom 0.508: J2.6 66.42,50.55 57.66,50.55 56.15,52.05 42.66,52.05 42.66,52.56 v41.89,53.32
N$21  (via drill 0.35)
  Top 0.508: U1.5 36.93,56.52 39.99,53.45 v40.63,54.09
  Top 0.813: 15.1 69.85,46.99 68.58,48.26 J2.7 63.5,48.26 62.23,46.99 R15.1
  Bottom 0.508: v40.63,54.09 40.63,52.08 41.66,51.05 44.55,51.05 47.51,48.26 J2.7
N$22  (via drill 0.35)
  Top 0.508: U1.6 36.96,57.78 39.37,55.37 v39.88,55.37
  Top 0.813: R16.1 61.81,44.45 65.41,44.45 J2.8 68.58,43.81 16.1
  Bottom 0.508: v39.88,55.37 39.37,54.86 39.37,51.82 40.89,50.29 43.94,50.29 48.51,45.72 J2.8
N$23  (via drill 0.35)
  Top 0.508: U2.11 37.97,38.73 v38.61,39.37
  Top 0.813: R17.1 17.1 44.45,51.44 J3.1
  Bottom 0.508: v38.61,39.37 37.85,38.61 32.51,38.61 32.51,47.5 40.51,47.5 J3.1
N$24  (via drill 0.35)
  Top 0.508: U2.12 36.96,40.01 37.59,40.64 v39.12,40.64
  Top 0.813: R18.1 18.1 45.09,48.26 43.18,46.35 J3.2
  Bottom 0.508: J3.2 41.78,46.48 33.53,46.48 33.53,40.13 33.78,39.88 36.58,39.88 37.34,40.64 v39.12,40.64
N$25  (via drill 0.35)
  Top 0.508: U2.13 36.7,41.27 37.59,42.16 38.35,42.16 v38.61,41.91
  Top 0.813: R19.1 19.1 45.09,45.09 43.81,43.81 J3.3
  Bottom 0.508: v38.61,41.91 38.61,43.18 39.37,43.94 41.78,43.94 J3.3
N$26
  Top 0.508: 41.02,41.27 J3.4 41.27,41.27 39.37,43.18 37.34,43.18 36.7,42.55 U2.14
  Top 0.813: R20.1 20.1 46.99,41.27 J3.4
N$27
  Top 0.508: J3.5 41.02,38.73 37.34,35.05 34.8,35.05 33.78,36.07 33.78,42.55 U2.3
  Top 0.813: R21.1 21.1 J3.5
N$28
  Top 0.508: J3.6 40.51,36.2 38.1,33.78 34.8,33.78 33.02,35.56 33.02,41.27 U2.4
  Top 0.813: 22.1 48.26,35.56 | 48.26,35.56 R22.1 | J3.6 47.62,36.2 48.26,35.56
N$29
  Top 0.508: J3.7 40.89,32.64 34.42,32.64 32.26,34.8 32.26,39.88 32.13,40.01 U2.5
  Top 0.813: R23.1 23.1 44.45,32.38 43.18,33.66 J3.7
N$30
  Top 0.508: J3.8 41.4,31.62 34.16,31.62 31.45,34.33 31.45,37.85 31.24,38.06 31.24,38.61 30.35,38.61 U2.6
  Top 0.813: R24.1 24.1 44.45,29.21 42.55,31.11 J3.8
N$31  (via drill 0.35)
  Top 0.508: U3.11 28.32,27.3 27.94,27.69 27.94,30.99 v25.65,33.27
  Top 0.813: 25.1 67.94,36.83 67.31,36.2 67.31,34.29 J4.1 64.14,36.83 R25.1
  Bottom 0.508: v25.65,33.27 25.4,33.53 26.92,35.05 40.49,35.05 40.62,34.92 43.2,34.92 43.33,35.05 65.91,35.05 J4.1
N$32  (via drill 0.35)
  Top 0.508: U3.12 27.56,26.04 26.67,26.92 26.67,30.73 v25.91,31.5
  Top 0.813: 26.1 69.85,33.66 68.58,32.38 67.31,32.38 J4.2 64.77,31.75 62.87,33.66 R26.1
  Bottom 0.508: J4.2 65.66,32.77 43.58,32.77 43.2,32.38 40.62,32.38 38.97,34.04 28.45,34.04 v25.91,31.5
N$33  (via drill 0.35)
  Top 0.508: U3.13 26.8,24.77 v26.42,25.15
  Top 0.813: 27.1 73.03,30.48 72.39,29.84 67.31,29.84 J4.3 62.87,29.21 61.59,30.48 R27.1
  Bottom 0.508: v26.42,25.15 26.42,30.48 29.21,33.27 37.19,33.27 40.62,29.84 43.2,29.84 44.85,31.5 64.01,31.5 64.77,30.73 64.77,29.46 65.02,29.21 J4.3
N$34  (via drill 0.35)
  Top 0.508: U3.14 27.56,23.5 27.43,23.37 26.92,23.37 v26.67,23.62
  Top 0.813: 28.1 67.31,27.3 J4.4 62.87,26.67 62.23,27.3 R28.1
  Bottom 0.508: 26.92,23.37 v26.67,23.62 27.43,24.38 27.43,29.97 29.72,32.26 | 29.72,32 29.72,32.26 | 29.72,32.26 37.13,32.26 40.31,29.08 43.51,29.08 44.4,29.97 62.99,29.97 63.75,29.21 63.75,27.69 64.77,26.67 J4.4
N$35  (via drill 0.35)
  Top 0.508: U3.3 38.67,23.5 39.94,24.77 41.02,24.77 42.42,26.16 42.42,27.94 v42.67,27.94
  Top 0.813: 29.1 J4.5 R29.1
  Bottom 0.508: v42.67,27.94 45.97,27.94 49.78,24.13 J4.5
N$36  (via drill 0.35)
  Top 0.508: U3.4 38.73,24.77 v40.89,26.92
  Top 0.813: 30.1 69.22,20.95 68.58,21.59 J4.6 66.04,20.95 R30.1
  Bottom 0.508: v40.89,26.92 41.15,26.67 45.21,26.67 50.55,21.34 66.42,21.34 J4.6
N$37  (via drill 0.35)
  Top 0.508: U3.5 38.48,26.04 38.61,26.16 v38.61,27.43
  Top 0.813: 31.1 69.85,17.78 68.58,19.05 J4.7 64.14,19.05 62.87,17.78 R31.1
  Bottom 0.508: v38.61,27.43 40.39,25.65 43.94,25.65 50.55,19.05 J4.7
N$38  (via drill 0.35)
  Top 0.508: U3.6 37.21,27.3 v37.34,27.43
  Top 0.813: 32.1 69.85,14.61 67.94,16.51 J4.8 65.41,16.51 63.5,14.61 R32.1
  Bottom 0.508: v37.34,27.43 37.34,27.18 39.75,24.77 43.31,24.77 47.5,20.57 47.5,16.26 66.42,16.26 J4.8
N$39
  Top 0.508: U4.11 31.5,11.43 32,11.94 32,15.43 34.74,18.16 36.9,18.16 39.12,20.38 39.12,22.86 39.75,23.5 J5.1
  Top 0.813: R33.1 33.1 44.45,26.04 J5.1
N$40
  Top 0.508: U4.12 32.51,10.16 32.77,10.41 32.77,15.11 35.06,17.4 37.21,17.4 40.77,20.95 J5.2
  Top 0.813: R34.1 34.1 45.09,22.86 43.18,20.95 J5.2
N$41
  Top 0.508: U4.13 33.53,8.89 33.53,14.79 35.37,16.64 37.72,16.64 39.5,18.41 J5.3
  Top 0.813: R35.1 35.1 45.09,19.68 43.81,18.41 J5.3
N$42
  Top 0.508: J5.4 35.69,15.88 34.29,14.48 34.29,7.62 U4.14
  Top 0.813: R36.1 36.1 46.99,15.88 J5.4
N$43  (via drill 0.35)
  Top 0.508: U4.3 36.83,7.62 v37.59,6.86
  Top 0.813: R37.1 37.1 J5.5
  Bottom 0.508: v37.59,6.86 34.54,6.86 34.04,7.37 34.04,12.95 34.42,13.34 J5.5
N$44  (via drill 0.35)
  Top 0.508: v38.35,7.87 37.34,8.89 U4.4
  Top 0.813: R38.1 38.1 44.45,10.16 43.81,10.79 J5.6
  Bottom 0.508: J5.6 40.51,10.79 38.86,12.45 35.05,12.45 35.05,7.87 v38.35,7.87
N$45
  Top 0.508: U4.5 38.1,10.16 40.13,8.13 42.29,8.13 42.42,8.26
  Top 0.813: R39.1 39.1 44.45,6.99 43.18,8.26 42.42,8.26 J5.7
N$46  (via drill 0.35)
  Top 0.508: U4.6 38.1,11.43 v38.35,11.18
  Top 0.813: R40.1 40.1 43.81,3.81 J5.8
  Bottom 0.508: v38.35,11.18 39.37,10.16 39.37,6.35 40.01,5.71 J5.8
SWITCH
  Top 0.508: U$1.D9 18.92,43.94 15.75,43.94 15.24,44.45 15.24,53.85 12.65,56.44 S1.1
VCC  (via drill 0.35)
  Top 0.762: U4.16 27.2,5.08 C6.2 26.95,6.41 26.92,6.44 26.92,7.87 v26.16,8.64 | U2.16 35.82,45.97 30.35,51.44 U1.16 26.01,51.44 C8.2 25.91,51.73 24.01,53.63 24.01,56.77 22.86,57.91 v22.86,58.17 | U6.16 35.82,77.46 35.56,77.72 24.64,77.72 24.38,77.47 24.38,77.24 C10.2 21.34,74.19 v21.34,73.91 | U3.16 26.26,16.99 C9.2 24.38,16 22.22,13.84 22.13,13.84 21.47,13.17 21.47,13.08 v17.02,8.64 17.02,8.38 16.76,8.13 16.76,22.35 16.26,22.86 9.65,22.86 | U$1.5V 9.65,22.86 | SL1.1 5.84,58.19 C7.2 5.82,55.14 6.13,54.83 | 9.65,22.86 9.65,51.31 6.22,54.74 6.13,54.83 | LED1.A 6.13,54.83
  Bottom 0.762: v26.16,8.64 17.53,8.64 17.27,8.38 v17.02,8.64 | v22.86,58.17 21.34,59.69 21.34,65.28 | 21.34,65.28 v21.34,73.91 | 21.34,65.28 6.22,65.28 SL1.1

### Text on the board
tNames: + | + | v1